# Altium schematic sheet Power_driver_AMP2.SchDoc
size 420 x 297 mm; Scale: 1:1; DocumentType: Схема электрическая принципиальная; FirstReferrence: АБВГ.123456.001
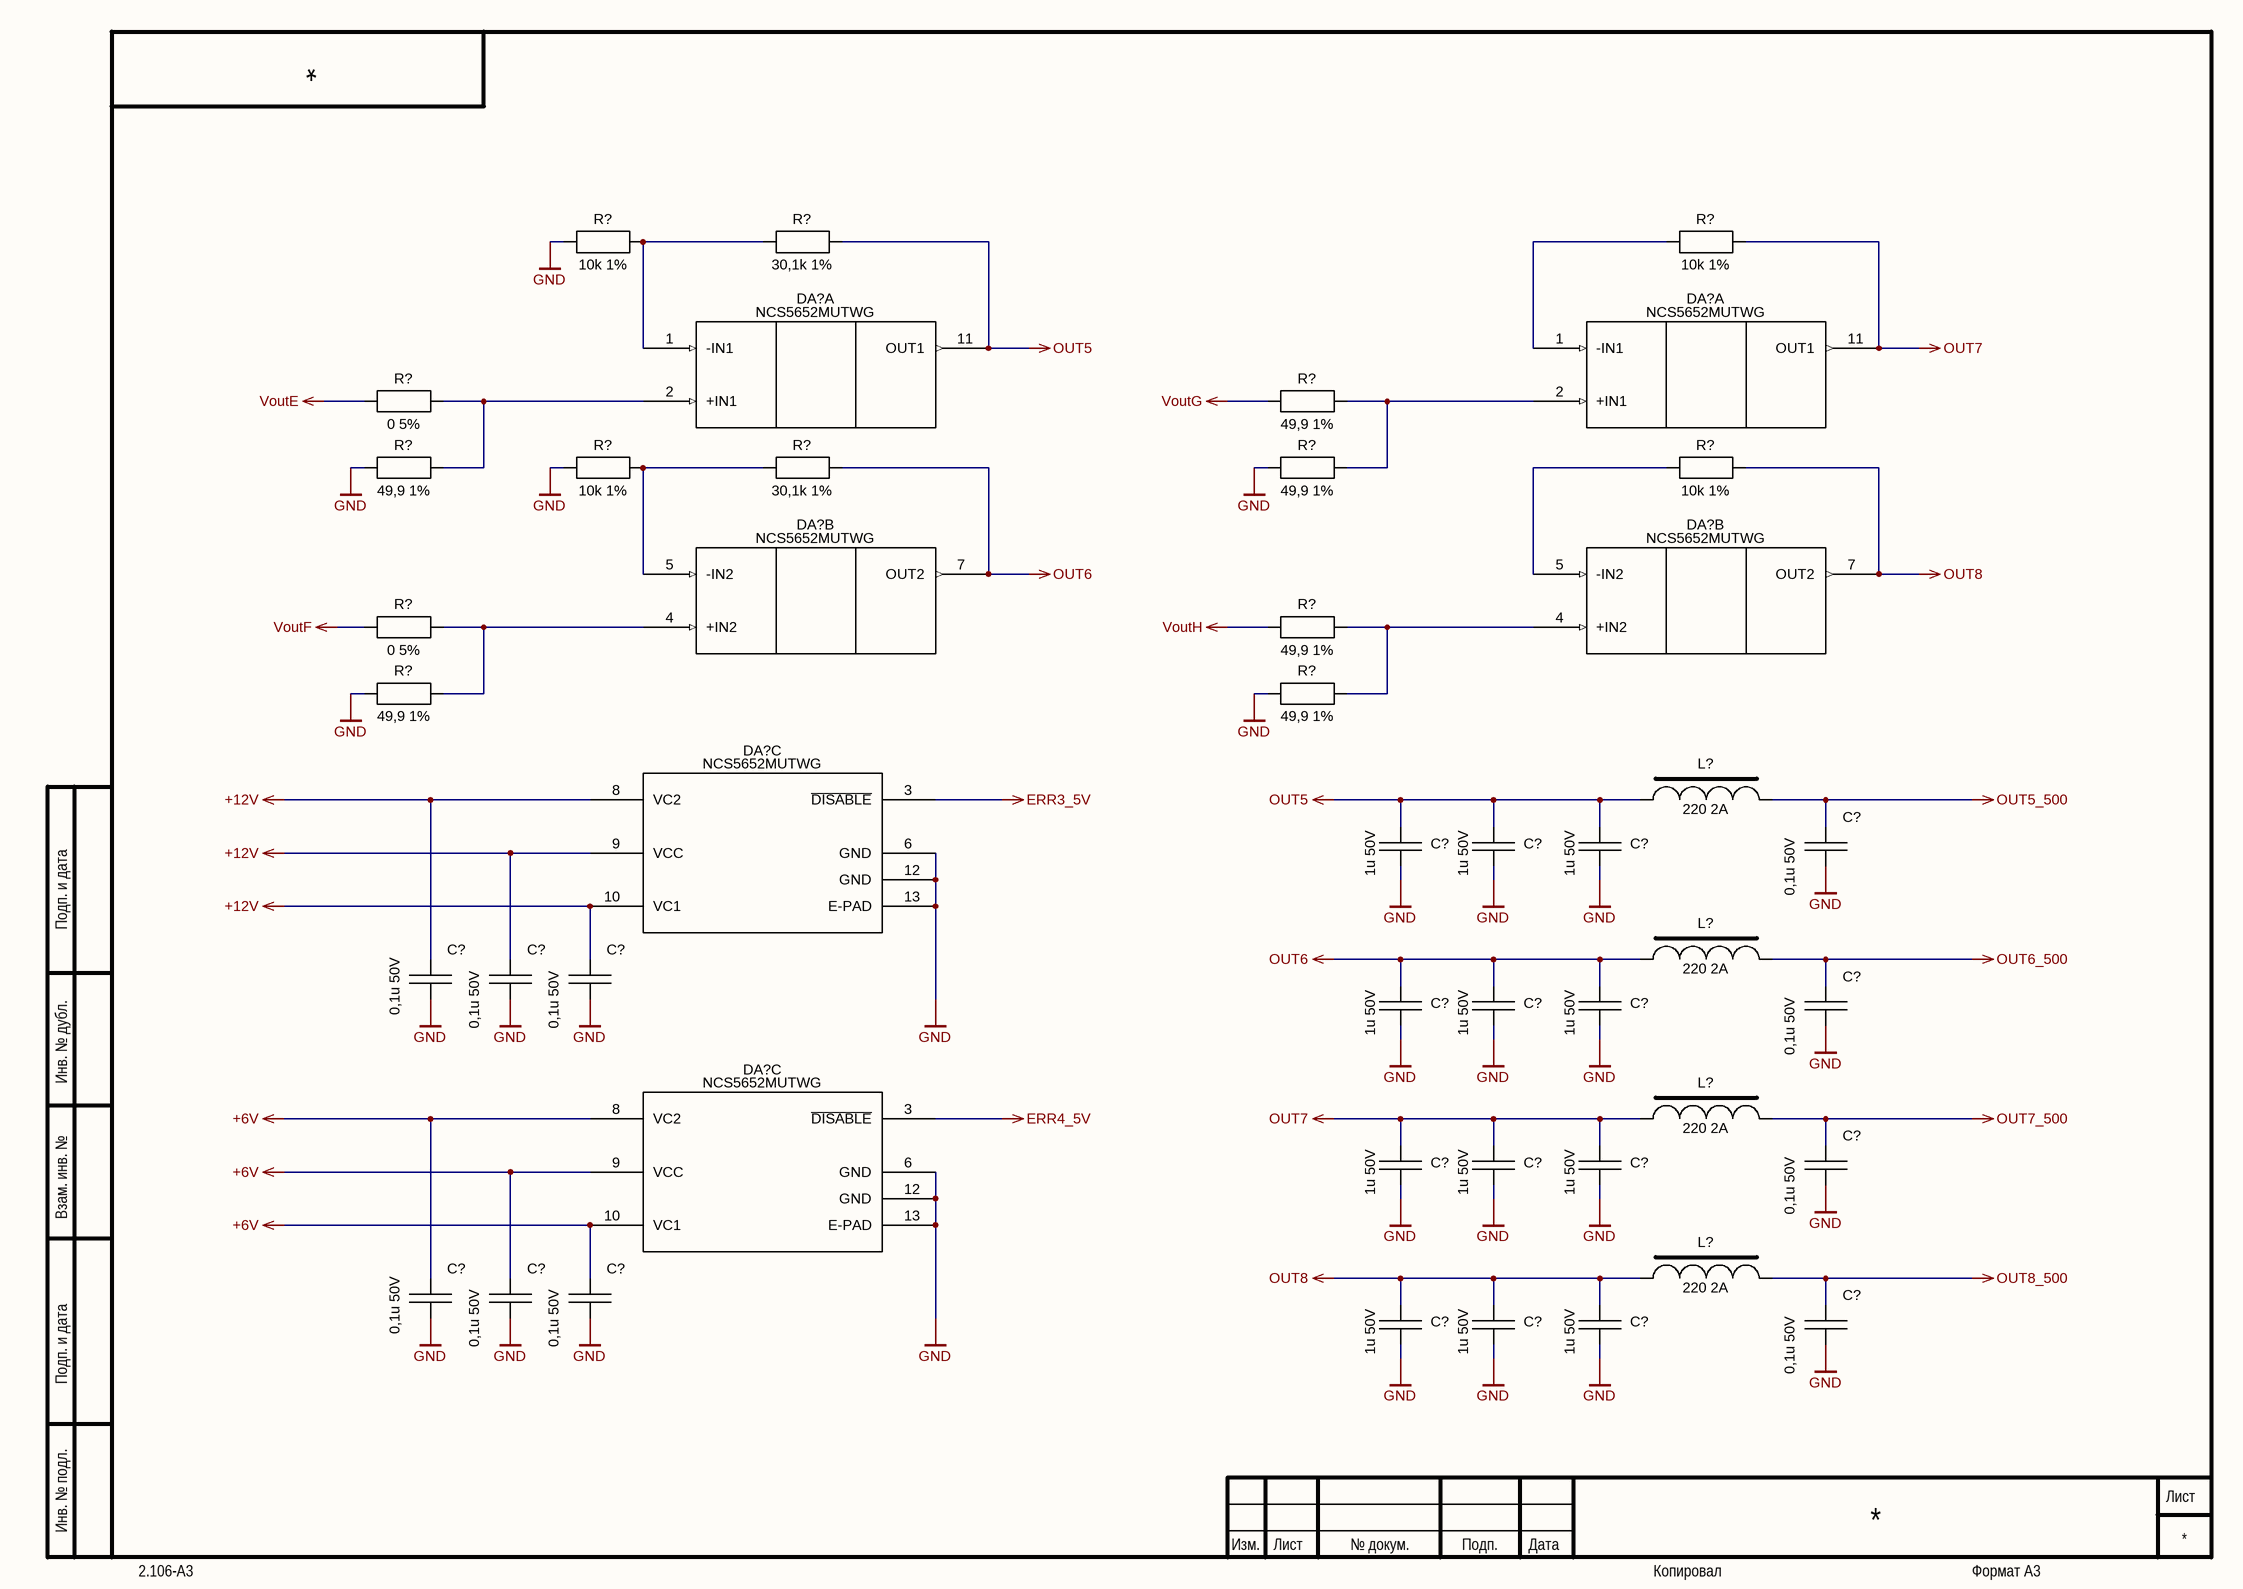
[diagram p0: Power_driver_AMP2.SchDoc]

## Parts
(Parts that share a designator on the sheet are numbered #1, #2 ... from top to bottom, then left to right.)
C?#1  0,1u 50V  [C0603_CAPC1608X09N]
C?#2  1u 50V  [C0603_CAPC1608X09N]
C?#3  1u 50V  [C0603_CAPC1608X09N]
C?#4  1u 50V  [C0603_CAPC1608X09N]
C?#5  0,1u 50V  [C0603_CAPC1608X09N]
C?#6  0,1u 50V  [C0603_CAPC1608X09N]
C?#7  0,1u 50V  [C0603_CAPC1608X09N]
C?#8  0,1u 50V  [C0603_CAPC1608X09N]
C?#9  1u 50V  [C0603_CAPC1608X09N]
C?#10  1u 50V  [C0603_CAPC1608X09N]
C?#11  1u 50V  [C0603_CAPC1608X09N]
C?#12  0,1u 50V  [C0603_CAPC1608X09N]
C?#13  1u 50V  [C0603_CAPC1608X09N]
C?#14  1u 50V  [C0603_CAPC1608X09N]
C?#15  1u 50V  [C0603_CAPC1608X09N]
C?#16  0,1u 50V  [C0603_CAPC1608X09N]
C?#17  0,1u 50V  [C0603_CAPC1608X09N]
C?#18  0,1u 50V  [C0603_CAPC1608X09N]
C?#19  0,1u 50V  [C0603_CAPC1608X09N]
C?#20  1u 50V  [C0603_CAPC1608X09N]
C?#21  1u 50V  [C0603_CAPC1608X09N]
C?#22  1u 50V  [C0603_CAPC1608X09N]
DA?#1  NCS5652MUTWG  [UDFN12 3x3, 0.5P]  (part A of 3)
DA?#2  NCS5652MUTWG  [UDFN12 3x3, 0.5P]  (part A of 3)
DA?#3  NCS5652MUTWG  [UDFN12 3x3, 0.5P]  (part B of 3)
DA?#4  NCS5652MUTWG  [UDFN12 3x3, 0.5P]  (part B of 3)
DA?#5  NCS5652MUTWG  [UDFN12 3x3, 0.5P]  (part C of 3)
DA?#6  NCS5652MUTWG  [UDFN12 3x3, 0.5P]  (part C of 3)
L?#1  220 2A  [I0805_INDC2012X11N]
L?#2  220 2A  [I0805_INDC2012X11N]
L?#3  220 2A  [I0805_INDC2012X11N]
L?#4  220 2A  [I0805_INDC2012X11N]
R?#1  10k 1%  [R0603_RESC1608X06N]
R?#2  30,1k 1%  [R0603_RESC1608X06N]
R?#3  10k 1%  [R0603_RESC1608X06N]
R?#4  0 5%  [R0603_RESC1608X06N]
R?#5  49,9 1%  [R0603_RESC1608X06N]
R?#6  49,9 1%  [R0603_RESC1608X06N]
R?#7  10k 1%  [R0603_RESC1608X06N]
R?#8  30,1k 1%  [R0603_RESC1608X06N]
R?#9  49,9 1%  [R0603_RESC1608X06N]
R?#10  10k 1%  [R0603_RESC1608X06N]
R?#11  0 5%  [R0603_RESC1608X06N]
R?#12  49,9 1%  [R0603_RESC1608X06N]
R?#13  49,9 1%  [R0603_RESC1608X06N]
R?#14  49,9 1%  [R0603_RESC1608X06N]

## Nets
+6V: C?#16.1 C?#17.1 C?#18.1 DA?#6.8(VC2) DA?#6.9(VCC) DA?#6.10(VC1)
+12V: C?#5.1 C?#6.1 C?#7.1 DA?#5.8(VC2) DA?#5.9(VCC) DA?#5.10(VC1)
ERR3_5V: DA?#5.3(~{DISABLE})
ERR4_5V: DA?#6.3(~{DISABLE})
GND: C?#1.2 C?#2.1 C?#3.1 C?#4.1 C?#5.2 C?#6.2 C?#7.2 C?#8.2 C?#9.1 C?#10.1 C?#11.1 C?#12.2 C?#13.1 C?#14.1 C?#15.1 C?#16.2 C?#17.2 C?#18.2 C?#19.2 C?#20.1 C?#21.1 C?#22.1 DA?#5.6(GND) DA?#5.12(GND) DA?#5.13(E-PAD) DA?#6.6(GND) DA?#6.12(GND) DA?#6.13(E-PAD) R?#1.1 R?#6.1 R?#7.1 R?#9.1 R?#13.1 R?#14.1
OUT5: C?#2.2 C?#3.2 C?#4.2 DA?#1.11(OUT1) L?#1.1 R?#2.2
OUT5_500: C?#1.1 L?#1.2
OUT6: C?#9.2 C?#10.2 C?#11.2 DA?#3.7(OUT2) L?#2.1 R?#8.2
OUT6_500: C?#8.1 L?#2.2
OUT7: C?#13.2 C?#14.2 C?#15.2 DA?#2.11(OUT1) L?#3.1 R?#3.2
OUT7_500: C?#12.1 L?#3.2
OUT8: C?#20.2 C?#21.2 C?#22.2 DA?#4.7(OUT2) L?#4.1 R?#10.2
OUT8_500: C?#19.1 L?#4.2
VoutE: R?#4.1
VoutF: R?#11.1
VoutG: R?#5.1
VoutH: R?#12.1
NetDA?#1_1: DA?#1.1(-IN1) R?#1.2 R?#2.1
NetDA?#1_2: DA?#1.2(+IN1) R?#4.2 R?#6.2
NetDA?#2_1: DA?#2.1(-IN1) R?#3.1
NetDA?#2_2: DA?#2.2(+IN1) R?#5.2 R?#9.2
NetDA?#3_4: DA?#3.4(+IN2) R?#11.2 R?#13.2
NetDA?#3_5: DA?#3.5(-IN2) R?#7.2 R?#8.1
NetDA?#4_4: DA?#4.4(+IN2) R?#12.2 R?#14.2
NetDA?#4_5: DA?#4.5(-IN2) R?#10.1

## Notes on the sheet
- Подп. и дата
- Инв. № дубл.
- Взам. инв. №
- Инв. № подл.
- Изм.
- Лист
- № докум.
- Подп.
- Дата
- 2.106-A3
- Копировал
- Формат А3

## Library data of the parts
C?#1 C?#5-C?#8 C?#12 C?#16-C?#19 = CC0603KRX7R9BB104: Конденсатор керамический (MLCC) общего назначения 0603; Manufacturer: YAGEO; ValueBOM: 0,1мкФ ±10% 50В X7R 0603; ModelSTEP: Z:\LIB\ALTIUM\MODEL\STEP\Capacitor\C0603_CAPC1608X09.Step; Designer: Dudarev; EOL: NO; PartNumber: CC0603KRX7R9BB104; ValueSCH: 0,1u 50V; Mount: SMT; HelpURL: Z:\LIB\ALTIUM\INFO\Capacitor\UPY-GPHC_X7R_6.3V-to-50V_13.pdf; Modify: 28.06.2016
C?#2-C?#4 C?#9-C?#11 C?#13-C?#15 C?#20-C?#22 = CC0603KRX7R9BB105: Конденсатор керамический (MLCC) общего назначения 0603; Manufacturer: YAGEO; ValueBOM: 1мкФ ±10% 50В X7R 0603; ModelSTEP: Z:\LIB\ALTIUM\MODEL\STEP\Capacitor\C0603_CAPC1608X09.Step; Designer: Dudarev; EOL: NO; PartNumber: CC0603KRX7R9BB105; ValueSCH: 1u 50V; Mount: SMT; HelpURL: Z:\LIB\ALTIUM\INFO\Capacitor\UPY-GPHC_X7R_6.3V-to-50V_13.pdf; Modify: 28.06.2016
DA?#1-DA?#6 = NCS5652MUTWG: High Speed, High Output Current, Dual Operational Amplifier, SMT
L?#1-L?#4 = BLM21PG221SN1D: Chip Ferrite Bead 220 Ohm, 2A, 0805; Manufacturer: Murata Electronics; ModelSTEP: Z:\LIB\ALTIUM\MODEL\STEP\Inductor\I0805_INDC2012X11.Step; Designer: Pashinskiy; EOL: NO; PartNumber: BLM21PG221SN1D; ValueBOM: BLM21PG221SN1D; ValueSCH: 220 2A; Mount: SMT; HelpURL: Z:\LIB\ALTIUM\INFO\Inductor\Chip%20Ferrite%20Bead%20BLM21P%200805.pdf; Modify: 16.08.2016
R?#1 R?#3 R?#7 R?#10 = RC0603FR-0710KL: Резистор толстопленочный общего назначения 0603; Manufacturer: YAGEO; ValueBOM: 10кОм 1% 75В 150ppm 0603; ModelSTEP: Z:\LIB\ALTIUM\MODEL\STEP\Resistor\R0603_RESC1005X04.step; Designer: Dudarev; EOL: NO; PartNumber: RC0603FR-0710KL; ValueSCH: 10k 1%; Mount: SMT; HelpURL: Z:\LIB\ALTIUM\INFO\Resistor\YAGEO\Lead free chip resistors RC_P.pdf; Modify: 28.06.2016
R?#2 R?#8 = RC0603FR-0730K1L: Резистор толстопленочный общего назначения 0603; Manufacturer: YAGEO; ValueBOM: 30,1кОм 1% 75В 150ppm 0603; ModelSTEP: Z:\LIB\ALTIUM\MODEL\STEP\Resistor\R0603_RESC1005X04.step; Designer: Dudarev; EOL: NO; PartNumber: RC0603FR-0730K1L; ValueSCH: 30,1k 1%; Mount: SMT; HelpURL: Z:\LIB\ALTIUM\INFO\Resistor\YAGEO\Lead free chip resistors RC_P.pdf; Modify: 28.06.2016
R?#4 R?#11 = RC0603JR-070RL: Резистор толстопленочный общего назначения 0603; Manufacturer: YAGEO; ValueBOM: 0Ом 5% 75В 300ppm 0603; ModelSTEP: Z:\LIB\ALTIUM\MODEL\STEP\Resistor\R0603_RESC1005X04.step; Designer: Dudarev; EOL: NO; PartNumber: RC0603JR-070RL; ValueSCH: 0 5%; Mount: SMT; HelpURL: Z:\LIB\ALTIUM\INFO\Resistor\YAGEO\Lead free chip resistors RC_P.pdf; Modify: 28.06.2016
R?#5 R?#6 R?#9 R?#12-R?#14 = RC0603FR-0749R9L: Резистор толстопленочный общего назначения 0603; Manufacturer: YAGEO; ValueBOM: 49,9Ом 1% 75В 200ppm 0603; ModelSTEP: Z:\LIB\ALTIUM\MODEL\STEP\Resistor\R0603_RESC1005X04.step; Designer: Dudarev; EOL: NO; PartNumber: RC0603FR-0749R9L; ValueSCH: 49,9 1%; Mount: SMT; HelpURL: Z:\LIB\ALTIUM\INFO\Resistor\YAGEO\Lead free chip resistors RC_P.pdf; Modify: 28.06.2016